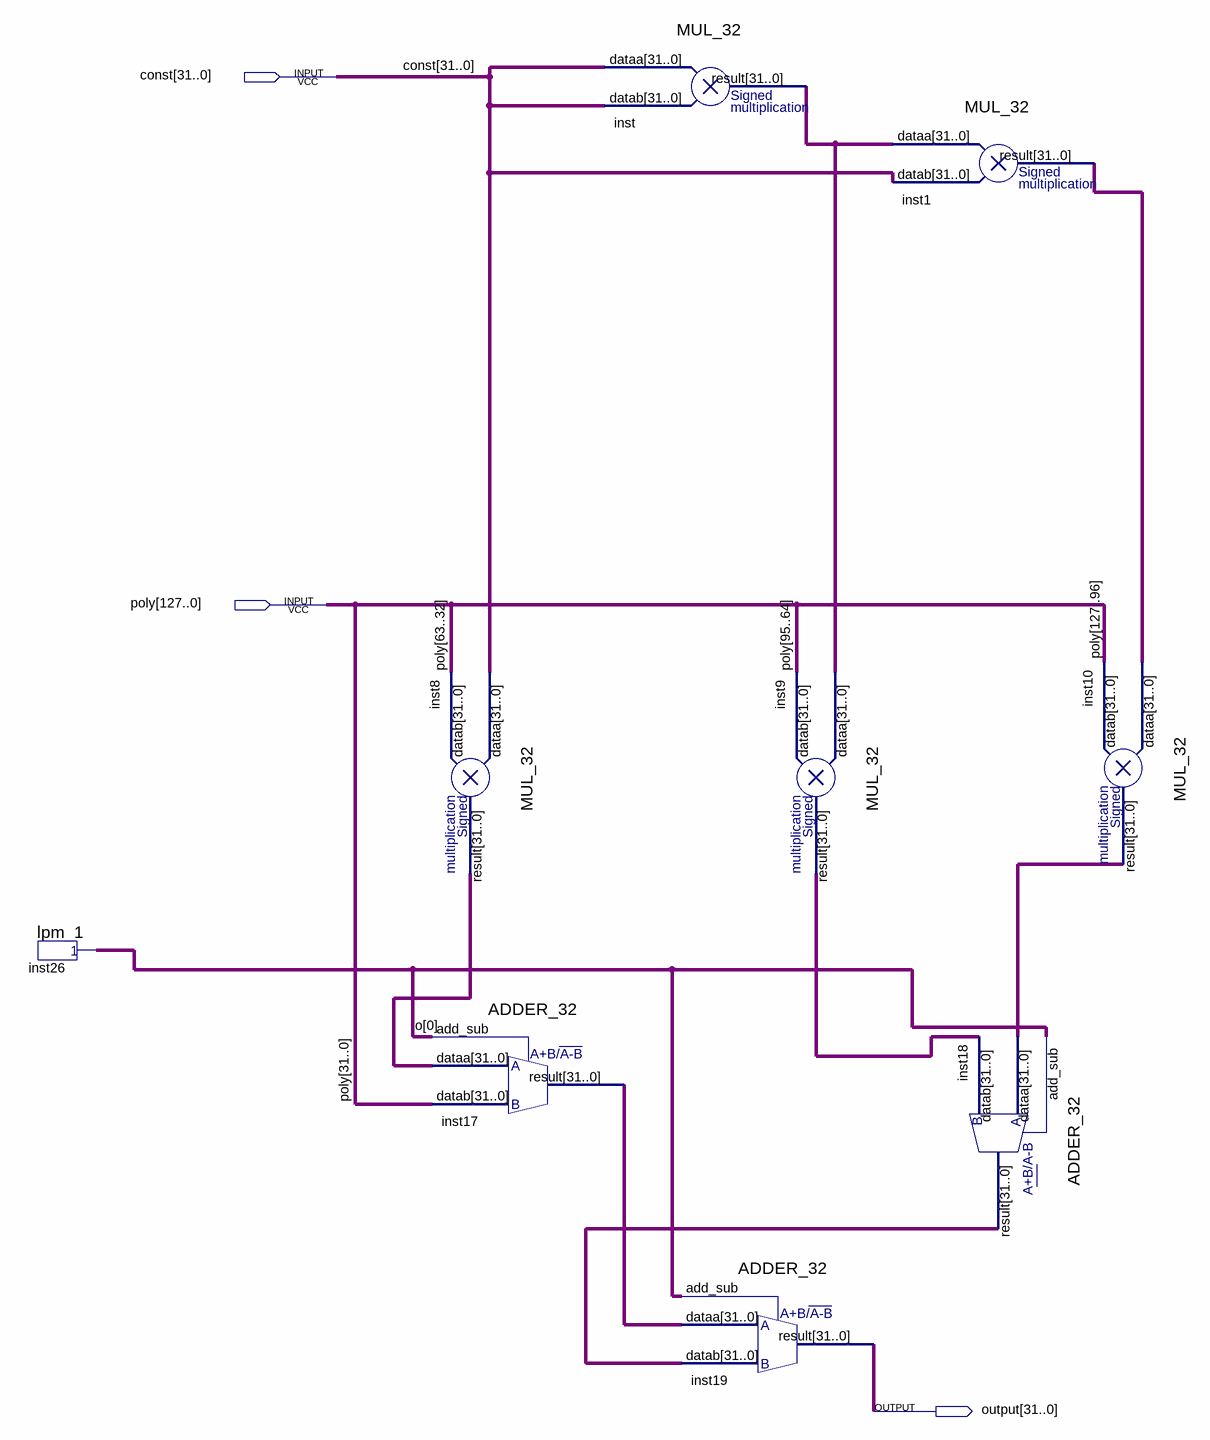
[diagram p0: schematic sheet]
// Quartus schematic Polynomial_AT_CONS.bdf as structural Verilog: 9 symbols, 3 pins
module Polynomial_AT_CONS (
  input  [31:0] \const ,
  input  [127:0] poly,
  output [31:0] \output 
);

  wire [0:0] o;
  wire [31:0] inst1_result, inst8_result, inst9_result, inst10_result, inst17_result, inst18_result,
       inst_result;

  lpm_1 inst26 (.result(o[0]));
  MUL_32 inst8 (.dataa(\const ), .datab(poly[63:32]), .result(inst8_result));
  ADDER_32 inst17 (.dataa(inst8_result), .datab(poly[31:0]), .add_sub(o[0]), .result(inst17_result));
  MUL_32 inst (.dataa(\const ), .datab(\const ), .result(inst_result));
  ADDER_32 inst19 (.dataa(inst17_result), .datab(inst18_result), .add_sub(o[0]), .result(\output ));
  MUL_32 inst9 (.dataa(inst_result), .datab(poly[95:64]), .result(inst9_result));
  MUL_32 inst1 (.dataa(inst_result), .datab(\const ), .result(inst1_result));
  ADDER_32 inst18 (.dataa(inst10_result), .datab(inst9_result), .add_sub(o[0]), .result(inst18_result));
  MUL_32 inst10 (.dataa(inst1_result), .datab(poly[127:96]), .result(inst10_result));
endmodule
